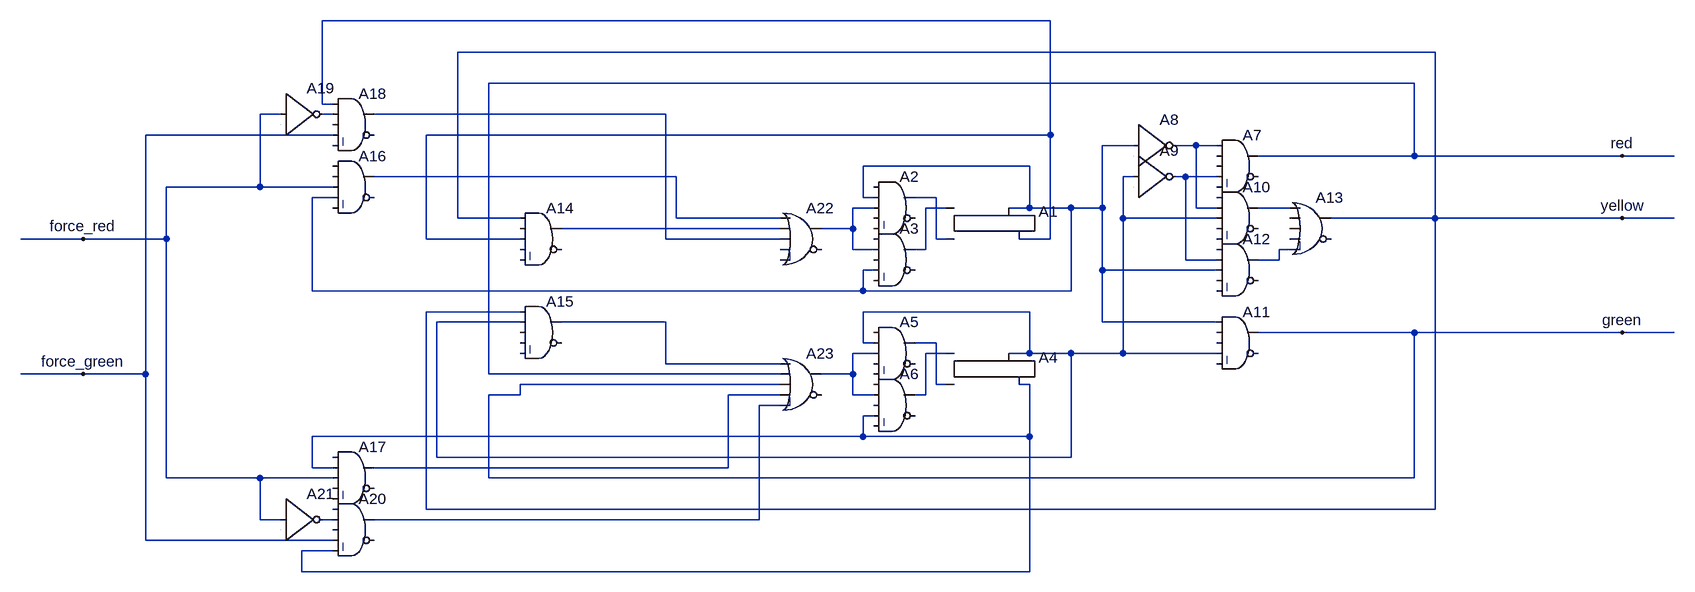
[diagram p0: schematic Draft1.asc]
Draft1.asc, the LTspice schematic file:
Version 4
SHEET 1 1204 680
WIRE 240 -176 -880 -176
WIRE 832 -128 -672 -128
WIRE 800 -80 -624 -80
WIRE -880 -48 -880 -176
WIRE -864 -48 -880 -48
WIRE -944 -32 -976 -32
WIRE -864 -32 -880 -32
WIRE -352 -32 -800 -32
WIRE -864 0 -1152 0
WIRE 240 0 240 -176
WIRE 240 0 -720 0
WIRE 368 16 320 16
WIRE 464 16 432 16
WIRE 496 16 464 16
WIRE 800 32 800 -80
WIRE 800 32 560 32
WIRE 1120 32 800 32
WIRE 1200 32 1120 32
WIRE 208 48 -48 48
WIRE -336 64 -800 64
WIRE 368 64 352 64
WIRE 448 64 432 64
WIRE 496 64 448 64
WIRE -976 80 -976 -32
WIRE -976 80 -1120 80
WIRE -864 80 -976 80
WIRE -864 96 -896 96
WIRE -48 96 -48 48
WIRE -32 96 -48 96
WIRE 64 96 32 96
WIRE -32 112 -64 112
WIRE 80 112 48 112
WIRE 208 112 208 48
WIRE 208 112 176 112
WIRE 272 112 208 112
WIRE 320 112 320 16
WIRE 320 112 272 112
WIRE 464 112 464 16
WIRE 496 112 464 112
WIRE 608 112 560 112
WIRE -672 128 -672 -128
WIRE -576 128 -672 128
WIRE -336 128 -336 64
WIRE -176 128 -336 128
WIRE 352 128 352 64
WIRE 496 128 352 128
WIRE 832 128 832 -128
WIRE 832 128 672 128
WIRE 1120 128 832 128
WIRE 1200 128 1120 128
WIRE -176 144 -512 144
WIRE -64 144 -64 112
WIRE -64 144 -112 144
WIRE -1248 160 -1344 160
WIRE -1120 160 -1120 80
WIRE -1120 160 -1248 160
WIRE -720 160 -720 0
WIRE -576 160 -720 160
WIRE -352 160 -352 -32
WIRE -176 160 -352 160
WIRE 64 160 64 96
WIRE 80 160 64 160
WIRE 240 160 240 0
WIRE 240 160 192 160
WIRE -64 176 -64 144
WIRE -32 176 -64 176
WIRE 48 176 48 112
WIRE 48 176 32 176
WIRE 608 176 592 176
WIRE 448 192 448 64
WIRE 496 192 448 192
WIRE 592 192 592 176
WIRE 592 192 560 192
WIRE -32 208 -48 208
WIRE 320 208 320 112
WIRE 496 208 320 208
WIRE -896 240 -896 96
WIRE -48 240 -48 208
WIRE -48 240 -896 240
WIRE 272 240 272 112
WIRE 272 240 -48 240
WIRE -576 272 -720 272
WIRE 208 272 -48 272
WIRE -576 288 -704 288
WIRE -352 288 -512 288
WIRE 320 288 320 208
WIRE 496 288 320 288
WIRE 800 304 560 304
WIRE 1120 304 800 304
WIRE 1200 304 1120 304
WIRE -48 320 -48 272
WIRE -32 320 -48 320
WIRE 64 320 32 320
WIRE -32 336 -64 336
WIRE 80 336 48 336
WIRE 208 336 208 272
WIRE 208 336 176 336
WIRE 272 336 208 336
WIRE 352 336 352 128
WIRE 352 336 272 336
WIRE 496 336 352 336
WIRE -352 352 -352 288
WIRE -176 352 -352 352
WIRE -1248 368 -1344 368
WIRE -1152 368 -1152 0
WIRE -1152 368 -1248 368
WIRE -624 368 -624 -80
WIRE -176 368 -624 368
WIRE -64 368 -64 336
WIRE -64 368 -112 368
WIRE -176 384 -576 384
WIRE 64 384 64 320
WIRE 80 384 64 384
WIRE 208 384 192 384
WIRE -576 400 -576 384
WIRE -576 400 -624 400
WIRE -176 400 -256 400
WIRE -64 400 -64 368
WIRE -32 400 -64 400
WIRE 48 400 48 336
WIRE 48 400 32 400
WIRE -176 416 -208 416
WIRE -32 432 -48 432
WIRE -48 464 -48 432
WIRE -48 464 -896 464
WIRE 208 464 208 384
WIRE 208 464 -48 464
WIRE -704 496 -704 288
WIRE 272 496 272 336
WIRE 272 496 -704 496
WIRE -896 512 -896 464
WIRE -864 512 -896 512
WIRE -256 512 -256 400
WIRE -256 512 -800 512
WIRE -1120 528 -1120 160
WIRE -976 528 -1120 528
WIRE -864 528 -976 528
WIRE -624 528 -624 400
WIRE 800 528 800 304
WIRE 800 528 -624 528
WIRE -720 576 -720 272
WIRE 832 576 832 128
WIRE 832 576 -720 576
WIRE -976 592 -976 528
WIRE -944 592 -976 592
WIRE -864 592 -880 592
WIRE -208 592 -208 416
WIRE -208 592 -800 592
WIRE -1152 624 -1152 368
WIRE -864 624 -1152 624
WIRE -864 640 -912 640
WIRE -912 672 -912 640
WIRE 208 672 208 464
WIRE 208 672 -912 672
FLAG 1120 32 red
FLAG 1120 304 green
FLAG 1120 128 yellow
FLAG -1248 160 force_red
FLAG -1248 368 force_green
SYMBOL Digital\\srflop 128 64 R0
SYMATTR InstName A1
SYMBOL Digital\\and 0 48 R0
SYMATTR InstName A2
SYMBOL Digital\\and 0 128 R0
SYMATTR InstName A3
SYMBOL Digital\\srflop 128 288 R0
SYMATTR InstName A4
SYMBOL Digital\\and 0 272 R0
SYMATTR InstName A5
SYMBOL Digital\\and 0 352 R0
SYMATTR InstName A6
SYMBOL Digital\\and 528 -16 R0
SYMATTR InstName A7
SYMBOL Digital\\inv 368 -48 R0
SYMATTR InstName A8
SYMBOL Digital\\inv 368 0 R0
SYMATTR InstName A9
SYMBOL Digital\\and 528 256 R0
SYMATTR InstName A11
SYMBOL Digital\\and 528 64 R0
SYMATTR InstName A10
SYMBOL Digital\\and 528 144 R0
SYMATTR InstName A12
SYMBOL Digital\\or 640 80 R0
SYMATTR InstName A13
SYMBOL Digital\\and -544 96 R0
SYMATTR InstName A14
SYMBOL Digital\\and -544 240 R0
SYMATTR InstName A15
SYMBOL Digital\\and -832 16 R0
SYMATTR InstName A16
SYMBOL Digital\\and -832 464 R0
SYMATTR InstName A17
SYMBOL Digital\\and -832 -80 R0
SYMATTR InstName A18
SYMBOL Digital\\inv -944 -96 R0
SYMATTR InstName A19
SYMBOL Digital\\and -832 544 R0
SYMATTR InstName A20
SYMBOL Digital\\inv -944 528 R0
SYMATTR InstName A21
SYMBOL Digital\\or -144 96 R0
SYMATTR InstName A22
SYMBOL Digital\\or -144 320 R0
SYMATTR InstName A23

The netlist it stands for:
* Draft1.asc
A1 N011 N009 0 0 0 N001 N004 0 SRFLOP
A2 0 N004 N010 0 0 0 N009 0 AND
A3 0 N010 0 N004 0 0 N011 0 AND
A4 N018 N016 0 0 0 N019 N007 0 SRFLOP
A5 0 N007 N017 0 0 0 N016 0 AND
A6 0 N017 0 N019 0 0 N018 0 AND
A7 N005 0 0 N008 0 0 red 0 AND
A8 N004 0 0 0 0 N005 0 0 BUF
A9 N007 0 0 0 0 N008 0 0 BUF
A11 N004 0 0 N007 0 0 green 0 AND
A10 0 N005 N007 0 0 0 N012 0 AND
A12 0 N008 N004 0 0 0 N014 0 AND
A13 N012 0 0 0 N014 0 yellow 0 OR
A14 yellow 0 N001 0 0 0 N013 0 AND
A15 yellow N007 0 0 0 0 N015 0 AND
A16 0 0 force_red N004 0 0 N006 0 AND
A17 0 N019 force_red 0 0 0 N020 0 AND
A18 N001 N002 0 force_green 0 0 N003 0 AND
A19 force_red 0 0 0 0 N002 0 0 BUF
A20 0 N022 0 force_green N019 0 N021 0 AND
A21 force_red 0 0 0 0 N022 0 0 BUF
A22 N006 N013 N003 0 0 0 N010 0 OR
A23 N015 red green N020 N021 0 N017 0 OR
.backanno
.end